# Altium project uMoteAdapter.PrjPCB
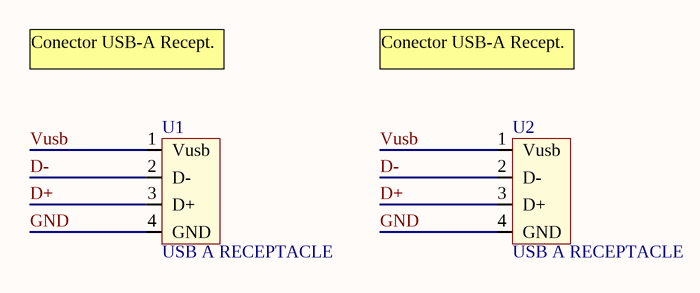
[diagram p0: adapter.SchDoc]
1 sheet, 2 parts. Net scope: global (net labels, ports and power ports of the same name join across sheets).
Board file: adapter.PcbDoc

## Sheet adapter.SchDoc
size A4

### Parts
U1  USB A RECEPTACLE  [USB A RECEPTACLE THD]
U2  USB A RECEPTACLE  [USB A RECEPTACLE THD]

### Nets
D+: U1.3(D+) U2.3(D+)
D-: U1.2(D-) U2.2(D-)
GND: U1.4(GND) U2.4(GND)
Vusb: U1.1(Vusb) U2.1(Vusb)

### Notes on the sheet
- Conector USB-A Recept.